# EAGLE design HV (EAGLE 9.3.1)
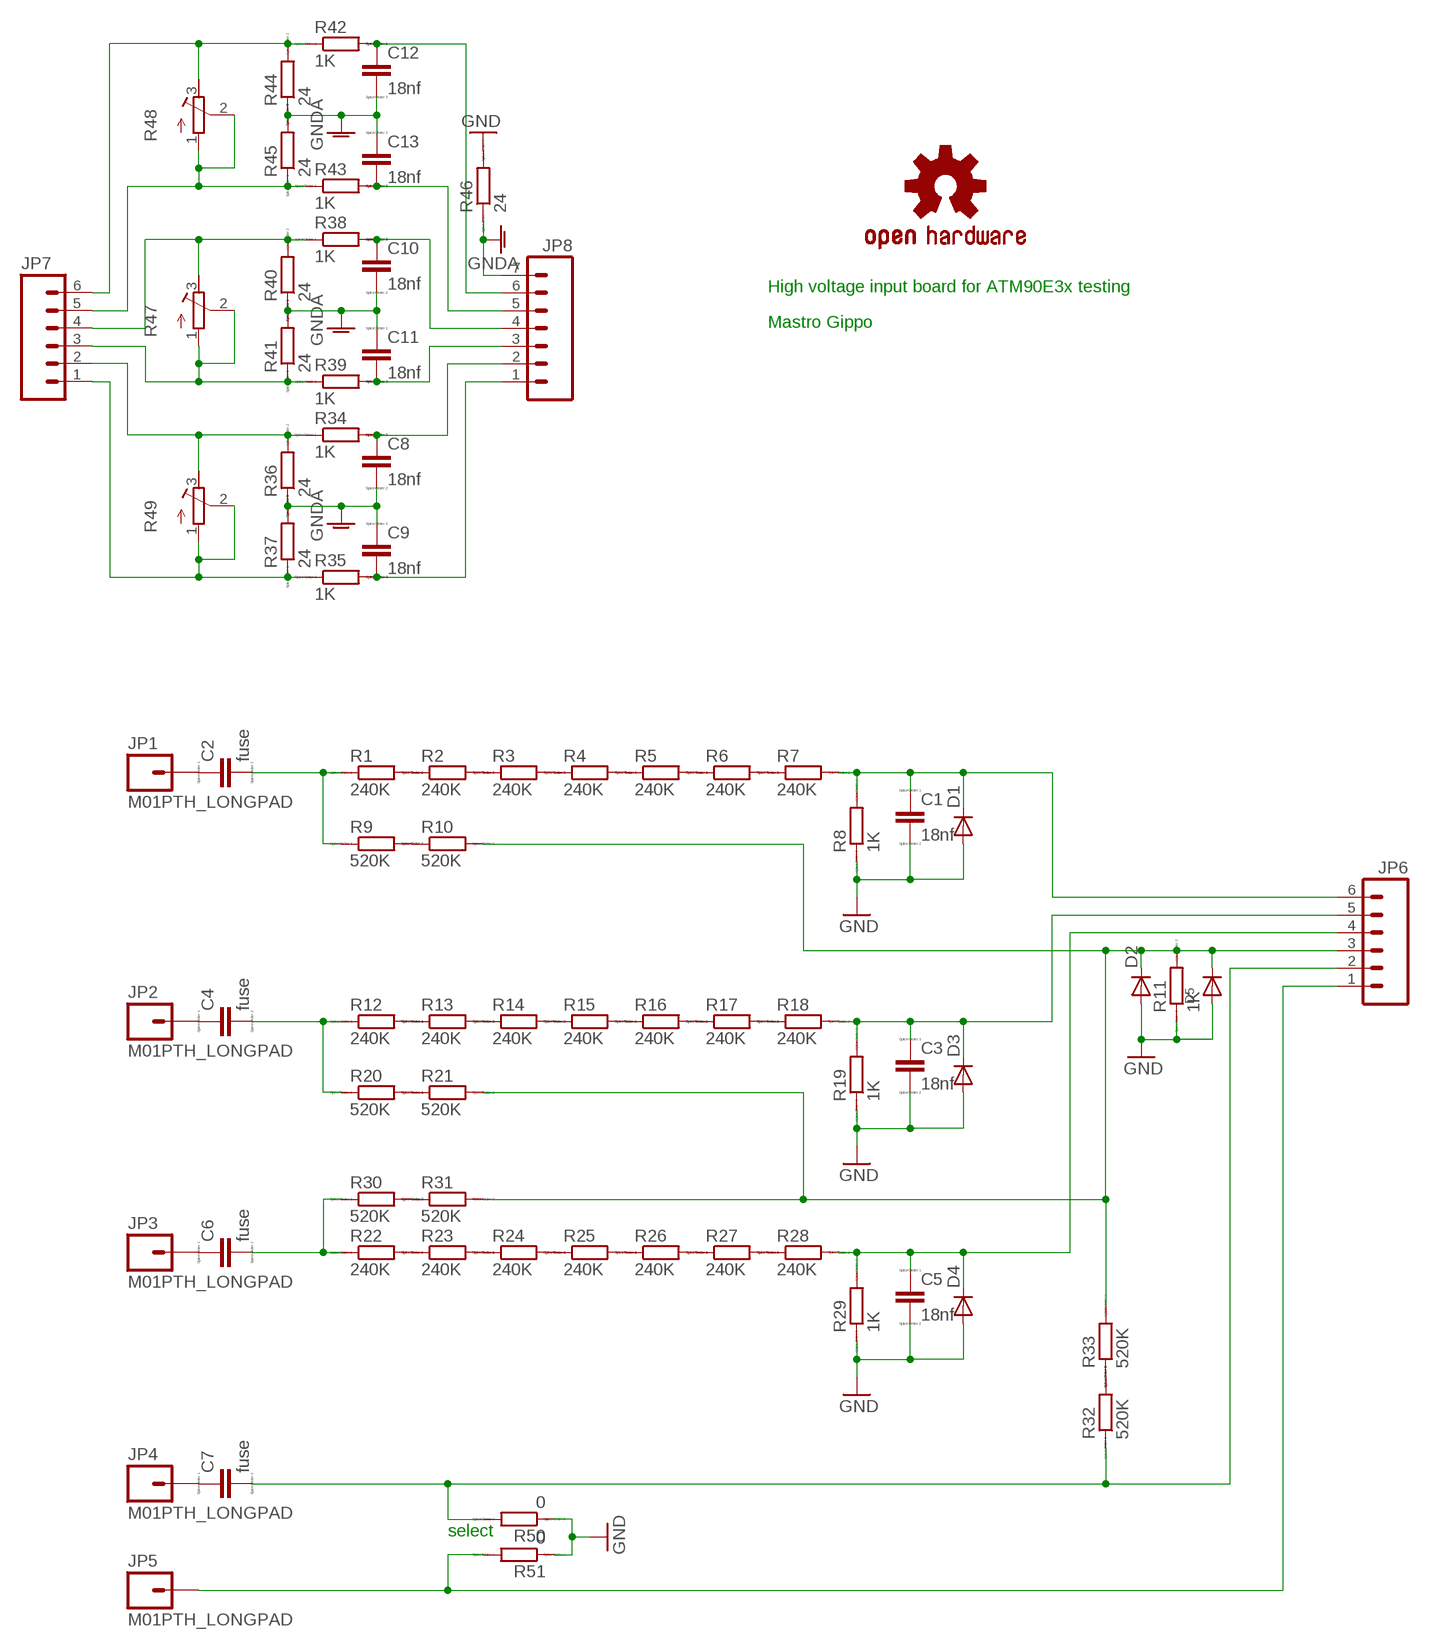
[diagram p0: schematic, sheet 1]

## Parts
C1  18nf  C-EUC0805K  [C0805K]
C2  fuse  C-EU050-025X075  [C050-025X075]
C3  18nf  C-EUC0805K  [C0805K]
C4  fuse  C-EU050-025X075  [C050-025X075]
C5  18nf  C-EUC0805K  [C0805K]
C6  fuse  C-EU050-025X075  [C050-025X075]
C7  fuse  C-EU050-025X075  [C050-025X075]
C8  18nf  C-EUC0805K  [C0805K]
C9  18nf  C-EUC0805K  [C0805K]
C10  18nf  C-EUC0805K  [C0805K]
C11  18nf  C-EUC0805K  [C0805K]
C12  18nf  C-EUC0805K  [C0805K]
C13  18nf  C-EUC0805K  [C0805K]
D1  DIODEHV  [DIODE-HV]
D2  DIODEHV  [DIODE-HV]
D3  DIODEHV  [DIODE-HV]
D4  DIODEHV  [DIODE-HV]
D5  DIODE_SOD-123FL  [SOD-123FL]
JP1  M01PTH_LONGPAD  [1X01_LONGPAD]
JP2  M01PTH_LONGPAD  [1X01_LONGPAD]
JP3  M01PTH_LONGPAD  [1X01_LONGPAD]
JP4  M01PTH_LONGPAD  [1X01_LONGPAD]
JP5  M01PTH_LONGPAD  [1X01_LONGPAD]
JP6  M06LONGPADS  [1X06_LONGPADS]
JP7  M06LONGPADS  [1X06_LONGPADS]
JP8  M07LONGPADS  [1X07_LONGPADS]
R1  240K  R-EU_R0805  [R0805]
R2  240K  R-EU_R0805  [R0805]
R3  240K  R-EU_R0805  [R0805]
R4  240K  R-EU_R0805  [R0805]
R5  240K  R-EU_R0805  [R0805]
R6  240K  R-EU_R0805  [R0805]
R7  240K  R-EU_R0805  [R0805]
R8  1K  R-EU_R0805  [R0805]
R9  520K  R-EU_R0805  [R0805]
R10  520K  R-EU_R0805  [R0805]
R11  1K  R-EU_R0805  [R0805]
R12  240K  R-EU_R0805  [R0805]
R13  240K  R-EU_R0805  [R0805]
R14  240K  R-EU_R0805  [R0805]
R15  240K  R-EU_R0805  [R0805]
R16  240K  R-EU_R0805  [R0805]
R17  240K  R-EU_R0805  [R0805]
R18  240K  R-EU_R0805  [R0805]
R19  1K  R-EU_R0805  [R0805]
R20  520K  R-EU_R0805  [R0805]
R21  520K  R-EU_R0805  [R0805]
R22  240K  R-EU_R0805  [R0805]
R23  240K  R-EU_R0805  [R0805]
R24  240K  R-EU_R0805  [R0805]
R25  240K  R-EU_R0805  [R0805]
R26  240K  R-EU_R0805  [R0805]
R27  240K  R-EU_R0805  [R0805]
R28  240K  R-EU_R0805  [R0805]
R29  1K  R-EU_R0805  [R0805]
R30  520K  R-EU_R0805  [R0805]
R31  520K  R-EU_R0805  [R0805]
R32  520K  R-EU_R0805  [R0805]
R33  520K  R-EU_R0805  [R0805]
R34  1K  R-EU_R0805  [R0805]
R35  1K  R-EU_R0805  [R0805]
R36  24  R-EU_R0805  [R0805]
R37  24  R-EU_R0805  [R0805]
R38  1K  R-EU_R0805  [R0805]
R39  1K  R-EU_R0805  [R0805]
R40  24  R-EU_R0805  [R0805]
R41  24  R-EU_R0805  [R0805]
R42  1K  R-EU_R0805  [R0805]
R43  1K  R-EU_R0805  [R0805]
R44  24  R-EU_R0805  [R0805]
R45  24  R-EU_R0805  [R0805]
R46  24  R-EU_R0805  [R0805]
R47  R-TRIMM3224J  [RTRIM3224J]
R48  R-TRIMM3224J  [RTRIM3224J]
R49  R-TRIMM3224J  [RTRIM3224J]
R50  0  R-EU_R0805  [R0805]
R51  0  R-EU_R0805  [R0805]
U$1  OSHW-LOGOS  [OSHW-LOGO-S]

## Nets
GND: C1.2 C3.2 C5.2 D1.A D2.A D3.A D4.A D5.A R8.1 R11.1 R19.1 R29.1 R46.2 R50.1 R51.1
GNDA: C8.2 C9.1 C10.2 C11.1 C12.2 C13.1 JP8.7 R36.1 R37.2 R40.1 R41.2 R44.1 R45.2 R46.1
N$1: C2.1 JP1.1
N$2: R1.2 R2.1
N$3: R2.2 R3.1
N$4: R3.2 R4.1
N$5: R4.2 R5.1
N$6: R5.2 R6.1
N$7: R6.2 R7.1
N$8: C1.1 D1.C JP6.6 R7.2 R8.2
N$9: R9.2 R10.1
N$10: C2.2 R1.1 R9.1
N$11: R32.2 R33.1
N$12: C3.1 D3.C JP6.5 R18.2 R19.2
N$13: C4.1 JP2.1
N$14: C4.2 R12.1 R20.1
N$15: R12.2 R13.1
N$16: R13.2 R14.1
N$17: R14.2 R15.1
N$18: R15.2 R16.1
N$19: R16.2 R17.1
N$20: R17.2 R18.1
N$21: R20.2 R21.1
N$22: C7.1 JP4.1
N$23: C5.1 D4.C JP6.4 R28.2 R29.2
N$24: C6.1 JP3.1
N$25: C6.2 R22.1 R30.1
N$26: R22.2 R23.1
N$27: R23.2 R24.1
N$28: R24.2 R25.1
N$29: R25.2 R26.1
N$30: R26.2 R27.1
N$31: R27.2 R28.1
N$32: R30.2 R31.1
N$33: D2.C D5.C JP6.3 R10.2 R11.2 R21.2 R31.2 R33.2
N$34: C7.2 JP6.2 R32.1 R50.2
N$35: JP7.2 R34.1 R36.2 R49.3(A)
N$36: JP7.3 R39.1 R41.1 R47.1(E) R47.2(S)
N$37: JP5.1 JP6.1 R51.2
N$38: C8.1 JP8.2 R34.2
N$39: C9.2 JP8.1 R35.2
N$40: JP7.5 R43.1 R45.1 R48.1(E) R48.2(S)
N$41: C10.1 JP8.4 R38.2
N$42: JP7.1 R35.1 R37.1 R49.1(E) R49.2(S)
N$43: JP7.6 R42.1 R44.2 R48.3(A)
N$45: C12.1 JP8.6 R42.2
N$47: JP7.4 R38.1 R40.2 R47.3(A)
N$50: C11.2 JP8.3 R39.2
N$54: C13.2 JP8.5 R43.2

## Notes on the sheet
- High voltage input board for ATM90E3x testing
- Mastro Gippo
- select

## Library data of the parts
C1-C13 = resistor:C-EU: CAPACITOR, European symbol; SPICEPREFIX: C
D1-D4 = SparkFun:DIODE: Diode
D5 = adafruit:DIODE: Diode
JP1-JP5 = SparkFun:M01: Header 1 Standard 1-pin 0.1" header. Use with straight break away headers (SKU : PRT-00116), right angle break away headers (PRT-00553), swiss pins (PRT-00743), machine pins (PRT-00117), and female headers (PRT-00115).
JP6 JP7 = SparkFun:M06: Header 6 Standard 6-pin 0.1" header. Use with straight break away headers (SKU : PRT-00116), right angle break away headers (PRT-00553), swiss pins (PRT-00743), machine pins (PRT-00117), and female headers (PRT-00115). Molex polarized connector foot print use with SKU : PRT-08094 with associated crimp pins and housings. NOTES ON THE VARIANTS LOCK and LOCK_LONGPADS... This footprint was designed to help hold the alignment of a through-hole component (i.e. 6-pin header) while soldering it into place. You may notice that each hole has been shifted either up or down by 0.005 of an inch from it's more standard position (which is a perfectly straight line). This slight alteration caused the pins (the squares in the middle) to touch the edges of the holes. Because they are alternating, it causes a "brace" to hold the component in place. 0.005 has proven to be the perfect amount of "off-center" position when using our standard breakaway headers. Although looks a little odd when you look at the bare footprint, once you have a header in there, the alteration is very hard to notice. Also, if you push a header all the way into place, it is covered up entirely on the bottom side. This idea of altering the position of holes to aid alignment will be further integrated into the Sparkfun Library for other footprints. It can help hold any component with 3 or more connection pins.
JP8 = SparkFun:M07: Header 7 Standard 7-pin 0.1" header. Use with straight break away headers (SKU : PRT-00116), right angle break away headers (PRT-00553), swiss pins (PRT-00743), machine pins (PRT-00117), and female headers (PRT-00115). NOTES ON THE VARIANTS LOCK and LOCK_LONGPADS... This footprint was designed to help hold the alignment of a through-hole component (i.e. 7-pin header) while soldering it into place. You may notice that each hole has been shifted either up or down by 0.005 of an inch from it's more standard position (which is usually a perfectly straight line). This slight alteration caused the pins (the squares in the middle) to touch the edges of the holes. Because they are alternating, it causes a "brace" to hold the header in place. 0.005 has proven to be the perfect amount of "off-center" position when using our standard breakaway headers. Although looks a little odd when you look at the bare footprint, once you have a header in there, the alteration is very hard to notice. Also, if you push a header all the way into place, it is covered up entirely on the bottom side. This idea of altering the position of holes to aid alignment will be further integrated into the Sparkfun Library for other footprints. It can help hold any component with 3 or more connection pins.
R1-R46 R50 R51 = resistor:R-EU_: RESISTOR, European symbol; SPICEPREFIX: R
R47-R49 = resistor:R-TRIMM: Trimm resistor
U$1 = SparkFun:OSHW-LOGO: Open Source Hardware Logo This logo indicates the piece of hardware it is found on incorporates a OSHW license and/or adheres to the definition of open source hardware found here: http://freedomdefined.org/OSHW

## Board
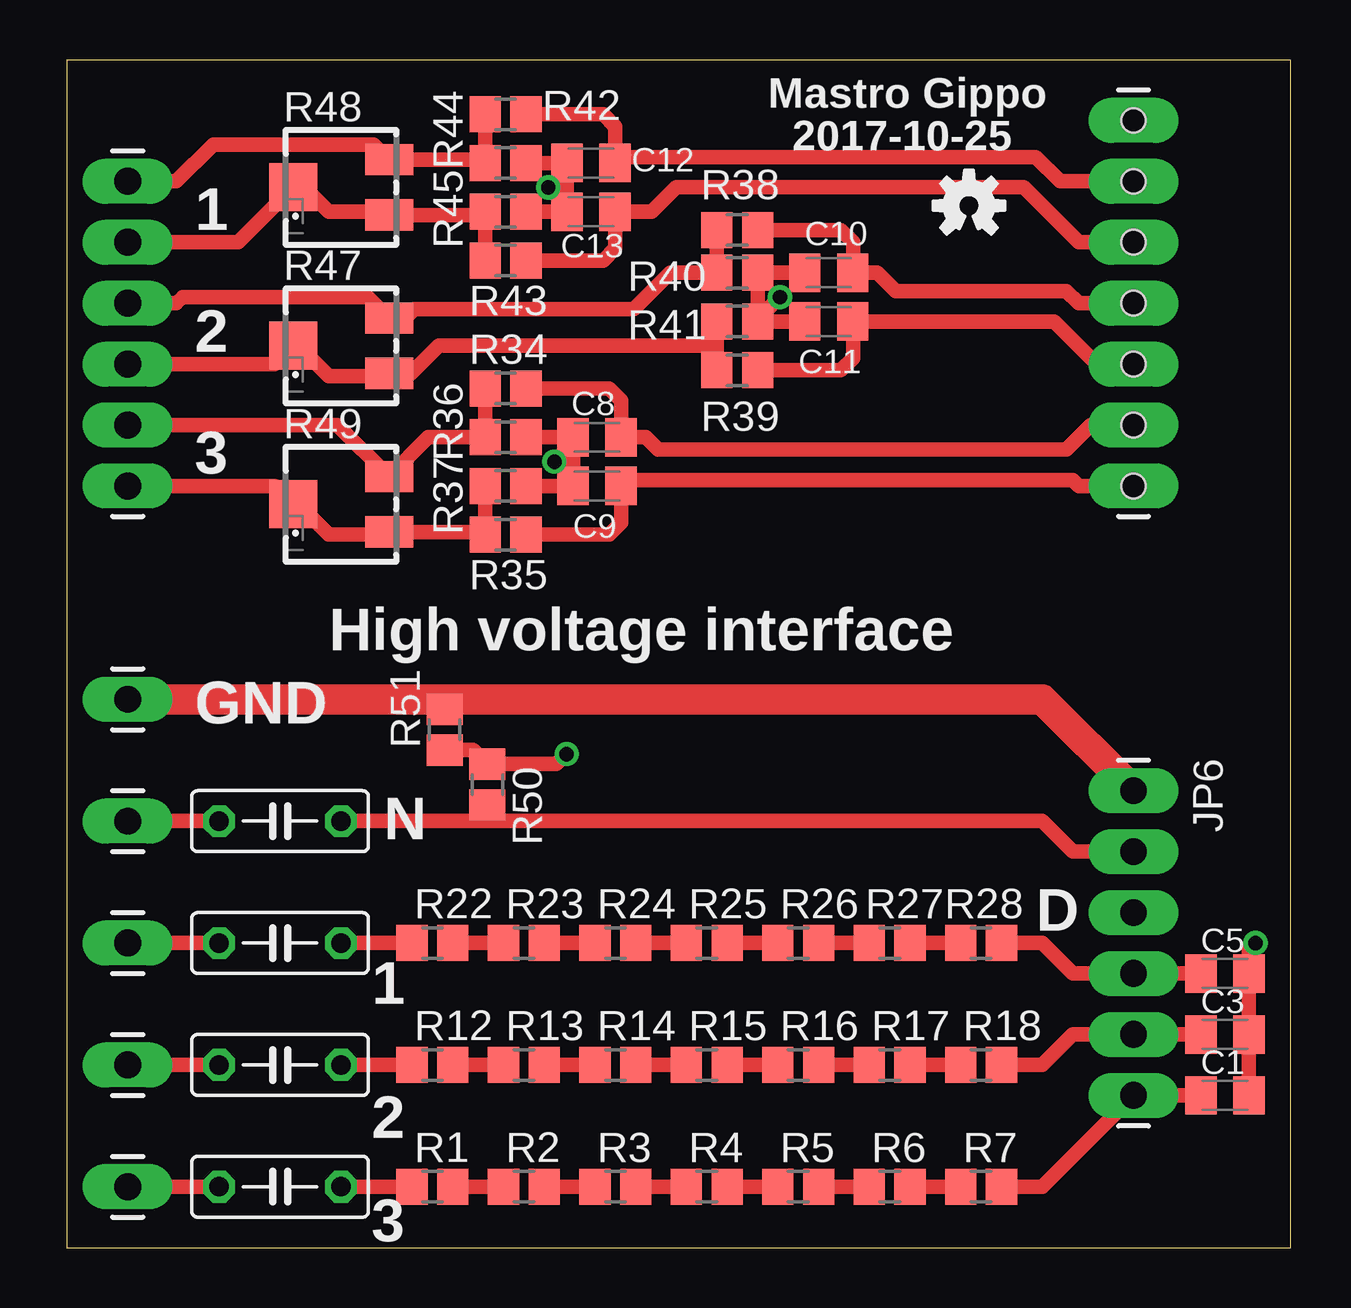
[diagram p1: board, top side]
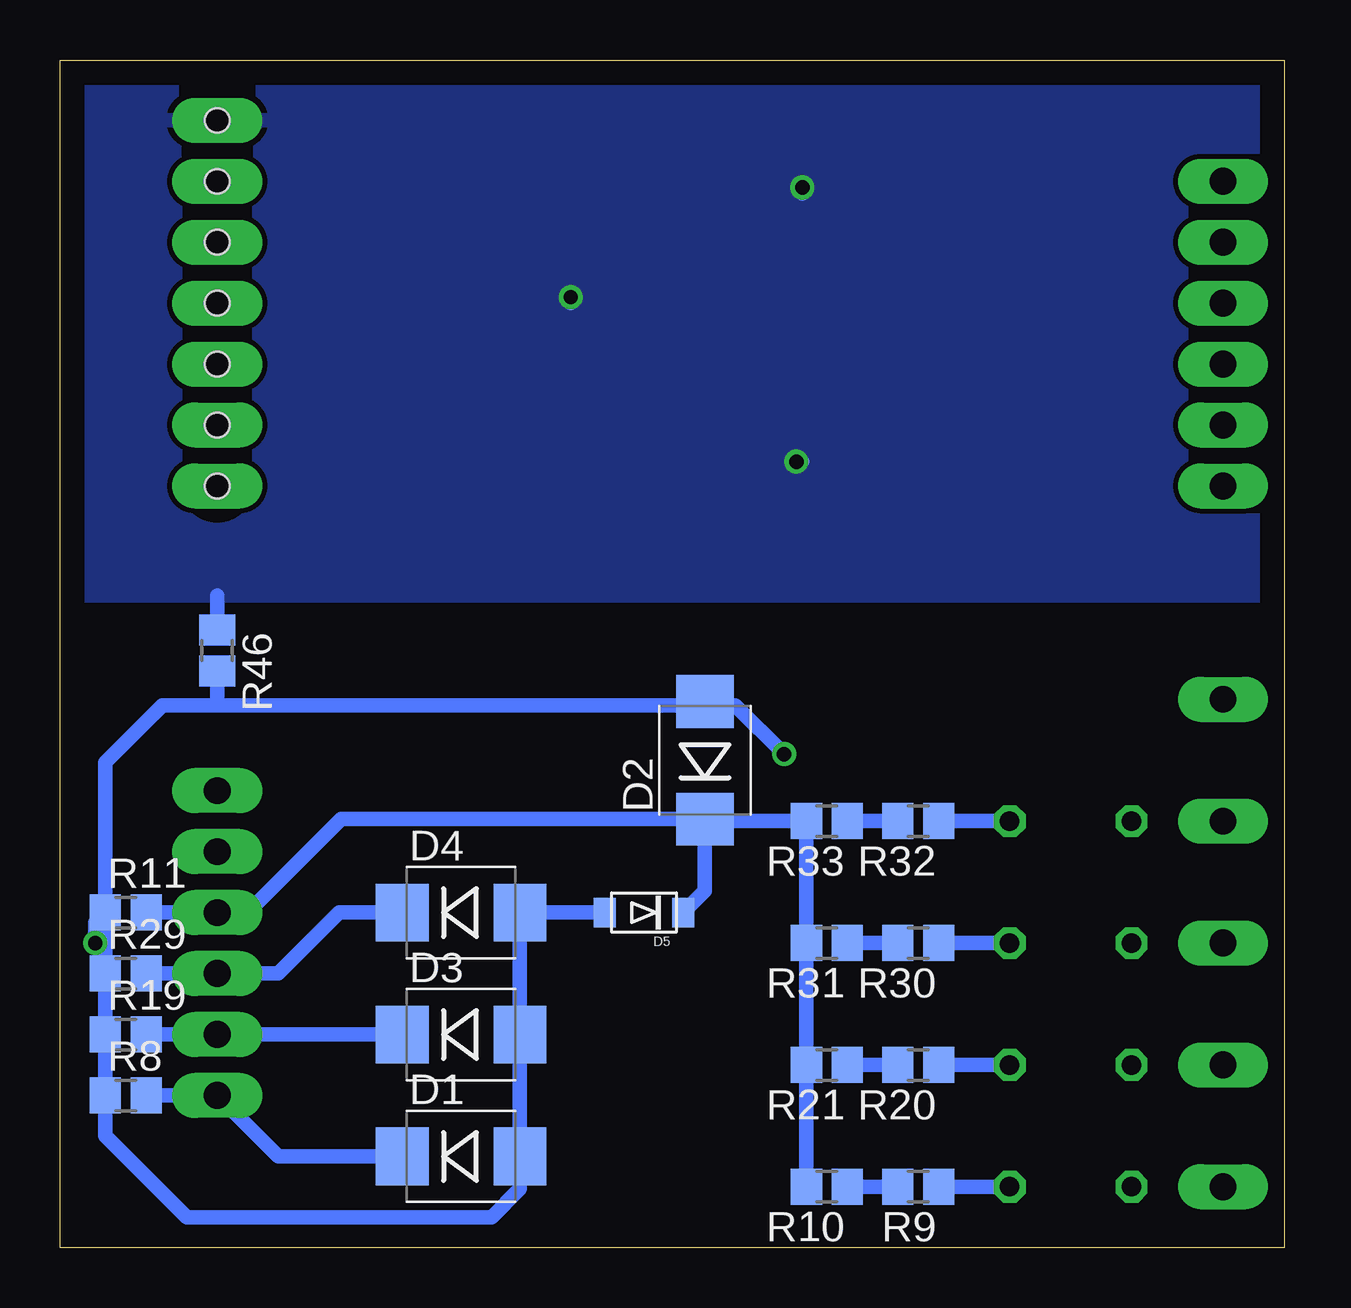
[diagram p2: board, bottom side, seen from below]

Size 51 x 49.51 mm. Coordinates in mm from the lower left corner, seen from the top.
Outline: 0,0 51,0 51,49.51 0,49.51 0,0
Copper layers (1*16): Top 0.035mm / dielectric 1.5mm / Bottom 0.035mm
Design rules "default": minimum track width 10mil, minimum drill 24mil, track to track 8mil, track to pad 8mil, pad to pad 8mil, via to via 8mil, smd to smd 8mil, copper to edge 40mil, drill to drill 8mil, minimum pad ring 10mil, minimum via ring 8mil, stop-mask expansion 4mil, vias tented up to drill 0mil, thermal gap 10mil

### Footprints (pad centres in the part's own frame; a part is rotated, then mirrored left to right if it is on the bottom)
C0805K = smd 1.3 x 1.6: 1 -1,0; 2 1,0
C050-025X075 = drill 0.813 octagon: 1 -2.54,0; 2 2.54,0
DIODE-HV = smd 2.2 x 2.4: A 2.454,0; C -2.454,0
SOD-123FL = smd 0.91 x 1.22: A 1.637,0; C -1.637,0
1X01_LONGPAD = drill 1.118 pad 1.88 long: 1 0,0
1X06_LONGPADS = drill 1.118 pad 1.88 long: 1 0,0; 2 2.54,0; 3 5.08,0; 4 7.62,0; 5 10.16,0; 6 12.7,0
1X07_LONGPADS = drill 1.016 pad 1.88 long: 1 0,0; 2 2.54,0; 3 5.08,0; 4 7.62,0; 5 10.16,0; 6 12.7,0; 7 15.24,0 | hole 1.016: 0,0; 2.54,0; 5.08,0; 7.62,0; 10.16,0; 12.7,0; 15.24,0
R0805 = smd 1.3 x 1.5: 1 -0.85,0; 2 0.85,0
RTRIM3224J = smd 1.3 x 2: 1 -1.15,-2; 3 1.15,-2 | smd 2 x 2: 2 0,2

### Placement (x,y rotation side)
C1  48.26,6.35 0 top
C2  8.89,2.54 0 top
C3  48.26,8.89 0 top
C4  8.89,7.62 0 top
C5  48.26,11.43 0 top
C6  8.89,12.7 0 top
C7  8.89,17.78 0 top
C8  22.1,33.78 180 top
C9  22.1,31.75 0 top
C10  31.75,40.64 180 top
C11  31.75,38.61 0 top
C12  21.84,45.21 180 top
C13  21.84,43.18 0 top
D1  34.29,3.81 0 bottom
D2  24.13,20.32 90 bottom
D3  34.29,8.89 0 bottom
D4  34.29,13.97 0 bottom
D5  26.67,13.97 180 bottom
JP1  2.54,2.54 90 top
JP2  2.54,7.62 90 top
JP3  2.54,12.7 90 top
JP4  2.54,17.78 90 top
JP5  2.54,22.86 90 top
JP6  44.45,19.05 270 top
JP7  2.54,31.75 90 top
JP8  44.45,31.75 90 top
R1  15.24,2.54 0 top
R2  19.05,2.54 0 top
R3  22.86,2.54 0 top
R4  26.67,2.54 0 top
R5  30.48,2.54 0 top
R6  34.29,2.54 0 top
R7  38.1,2.54 0 top
R8  48.26,6.35 0 bottom
R9  15.24,2.54 180 bottom
R10  19.05,2.54 180 bottom
R11  48.26,13.97 0 bottom
R12  15.24,7.62 0 top
R13  19.05,7.62 0 top
R14  22.86,7.62 0 top
R15  26.67,7.62 0 top
R16  30.48,7.62 0 top
R17  34.29,7.62 0 top
R18  38.1,7.62 0 top
R19  48.26,8.89 0 bottom
R20  15.24,7.62 180 bottom
R21  19.05,7.62 180 bottom
R22  15.24,12.7 0 top
R23  19.05,12.7 0 top
R24  22.86,12.7 0 top
R25  26.67,12.7 0 top
R26  30.48,12.7 0 top
R27  34.29,12.7 0 top
R28  38.1,12.7 0 top
R29  48.26,11.43 0 bottom
R30  15.24,12.7 180 bottom
R31  19.05,12.7 180 bottom
R32  15.24,17.78 180 bottom
R33  19.05,17.78 180 bottom
R34  18.29,35.81 0 top
R35  18.29,29.72 0 top
R36  18.29,33.78 180 top
R37  18.29,31.75 0 top
R38  27.94,42.42 0 top
R39  27.94,36.58 0 top
R40  27.94,40.64 180 top
R41  27.94,38.61 0 top
R42  18.29,47.24 0 top
R43  18.29,41.15 0 top
R44  18.29,45.21 180 top
R45  18.29,43.18 0 top
R46  44.45,24.89 270 bottom
R47  11.43,37.59 90 top
R48  11.43,44.2 90 top
R49  11.43,30.99 90 top
R50  17.53,19.3 270 top
R51  15.75,21.59 90 top
U$1  37.59,43.43 0 top

### Tracks (layer width: path | path; a pad name or v marks a point on that pad's centre or on a via)
GND  (via drill 0.6)
  Top 0.61: C1.2 C3.2 C5.2 49.26,12.43 v49.53,12.7 | R51.1 16.94,20.74 R50.1 20.41,20.15 v20.83,20.57
  Bottom 0.61: v20.83,20.57 22.86,22.61 23.96,22.61 | 23.96,22.61 D2.A | 23.96,22.61 44.45,22.61 | 44.45,22.61 46.74,22.61 49.11,20.23 R11.1 | v49.53,12.7 49.53,13.55 R11.1 | R11.1 R29.1 R19.1 R8.1 49.11,4.66 45.72,1.27 33.02,1.27 31.84,2.45 D1.A D3.A D4.A D5.A | R46.2 44.45,22.61
GNDA  (via drill 0.6)
  Top 0.61: R36.1 C8.2 | C8.2 C9.1 R37.2 | C8.2 21.1,33.54 v20.32,32.77 | C10.2 R40.1 R41.2 | C11.1 R41.2 | R41.2 28.79,38.7 v29.72,39.62 | R45.2 C13.1 | R44.1 C12.2 C13.1 | C13.1 20.84,43.42 v20.07,44.2
  Bottom 0.61: v20.32,32.77 20.07,32.77 | v29.72,39.62 29.72,39.37 | v20.07,44.2 20.07,43.94 | R46.1 44.45,27.18
  pour Bottom: 0,49.53 50.8,49.53 50.8,27.18 0,27.18
N$1
  Top 0.61: JP1.1 C2.1
N$2
  Top 0.61: R2.1 R1.2
N$3
  Top 0.61: R2.2 R3.1
N$4
  Top 0.61: R3.2 R4.1
N$5
  Top 0.61: R4.2 R5.1
N$6
  Top 0.61: R5.2 R6.1
N$7
  Top 0.61: R6.2 R7.1
N$8
  Top 0.61: R7.2 40.64,2.54 JP6.6 C1.1
  Bottom 0.61: D1.C 41.91,3.81 JP6.6 R8.2
N$9
  Bottom 0.61: R9.2 R10.1
N$10
  Top 0.61: C2.2 R9.1
  Bottom 0.61: R9.1 C2.2
N$11
  Bottom 0.61: R32.2 R33.1
N$12
  Top 0.61: R18.2 40.64,7.62 41.91,8.89 JP6.5 C3.1
  Bottom 0.61: R19.2 JP6.5 D3.C
N$13
  Top 0.61: C4.1 JP2.1
N$14
  Top 0.61: R20.1 C4.2
  Bottom 0.61: C4.2 R20.1
N$15
  Top 0.61: R13.1 R12.2
N$16
  Top 0.61: R13.2 R14.1
N$17
  Top 0.61: R15.1 R14.2
N$18
  Top 0.61: R15.2 R16.1
N$19
  Top 0.61: R16.2 R17.1
N$20
  Top 0.61: R17.2 R18.1
N$21
  Bottom 0.61: R20.2 R21.1
N$22
  Top 0.61: C7.1 JP4.1
N$23
  Top 0.61: R28.2 40.64,12.7 41.91,11.43 JP6.4 C5.1
  Bottom 0.61: D4.C 39.37,13.97 41.91,11.43 JP6.4 R29.2
N$24
  Top 0.61: JP3.1 C6.1
N$25
  Top 0.61: R30.1 C6.2
  Bottom 0.61: R30.1 C6.2
N$26
  Top 0.61: R22.2 R23.1
N$27
  Top 0.61: R23.2 R24.1
N$28
  Top 0.61: R24.2 R25.1
N$29
  Top 0.61: R25.2 R26.1
N$30
  Top 0.61: R26.2 R27.1
N$31
  Top 0.61: R27.2 R28.1
N$32
  Bottom 0.61: R30.2 R31.1
N$33
  Bottom 0.61: R10.2 R21.2 R31.2 R33.2 24.04,17.78 D2.C | D2.C 39.28,17.87 43.18,13.97 JP6.3 R11.2 | D2.C 24.13,14.87 D5.C
N$34
  Top 0.61: JP6.2 41.91,16.51 40.64,17.78 17.27,17.78 | 17.27,17.78 C7.2 | R50.2 17.53,18.03 17.27,17.78
  Bottom 0.61: C7.2 R32.1
N$35
  Top 0.61: R34.1 R36.2 15.07,33.78 R49.3 11.28,34.29 JP7.2
N$36
  Top 0.61: R39.1 27.09,37.59 | 27.09,37.59 R41.1 | JP7.3 8.67,36.83 R47.2 9.65,37.59 10.92,36.32 13.31,36.32 R47.1 14.34,36.44 15.49,37.59 27.09,37.59
N$37
  Top 1.27: JP5.1 15.49,22.86 | 15.49,22.86 40.64,22.86 JP6.1 | R51.2 15.75,22.61 15.49,22.86
N$38
  Top 0.61: R34.2 22.61,35.81 23.11,35.31 23.11,33.8 C8.1 24.13,33.78 24.64,33.27 41.66,33.27 42.67,34.29 JP8.2
N$39
  Top 0.61: R35.2 22.61,29.72 23.11,30.23 23.11,31.73 C9.2 23.35,32 41.91,32 42.16,31.75 JP8.1
N$40
  Top 0.61: R43.1 R45.1 17.3,43.05 R48.1 13.3,43.18 10.92,43.18 9.91,44.2 R48.2 7.14,41.91 JP7.5
N$41
  Top 0.61: R38.2 32.26,42.42 32.77,41.91 32.77,40.66 C10.1 33.78,40.64 34.54,39.88 41.66,39.88 42.16,39.37 JP8.4
N$42
  Top 0.61: R37.1 R35.1 17.32,29.84 R49.1 13.31,29.72 10.92,29.72 9.65,30.99 R49.2 8.67,31.75 JP7.1
N$43
  Top 0.61: R42.1 R44.2 17.3,45.35 R48.3 12.8,45.97 6.1,45.97 4.57,44.45 JP7.6
N$45
  Top 0.61: JP8.6 41.4,44.45 40.39,45.47 23.1,45.47 C12.1 22.86,45.23 22.86,46.74 22.35,47.24 R42.2
N$47
  Top 0.61: R38.1 R40.2 25.15,40.64 23.62,39.12 14.48,39.12 14.1,38.74 R47.3 12.55,39.62 4.83,39.62 4.57,39.37 JP7.4
N$50
  Top 0.61: R39.2 32.26,36.58 32.77,37.08 32.77,38.59 C11.2 41.15,38.61 42.93,36.83 JP8.3
N$54
  Top 0.61: JP8.5 42.16,41.91 39.88,44.2 25.4,44.2 24.38,43.18 C13.2 22.86,43.16 22.86,41.66 22.35,41.15 R43.2

### Text on the board
tNames: Mastro Gippo | 2017-10-25 | 1 | 2 | 3 | High voltage interface | GND | N | D | 1 | 2 | 3